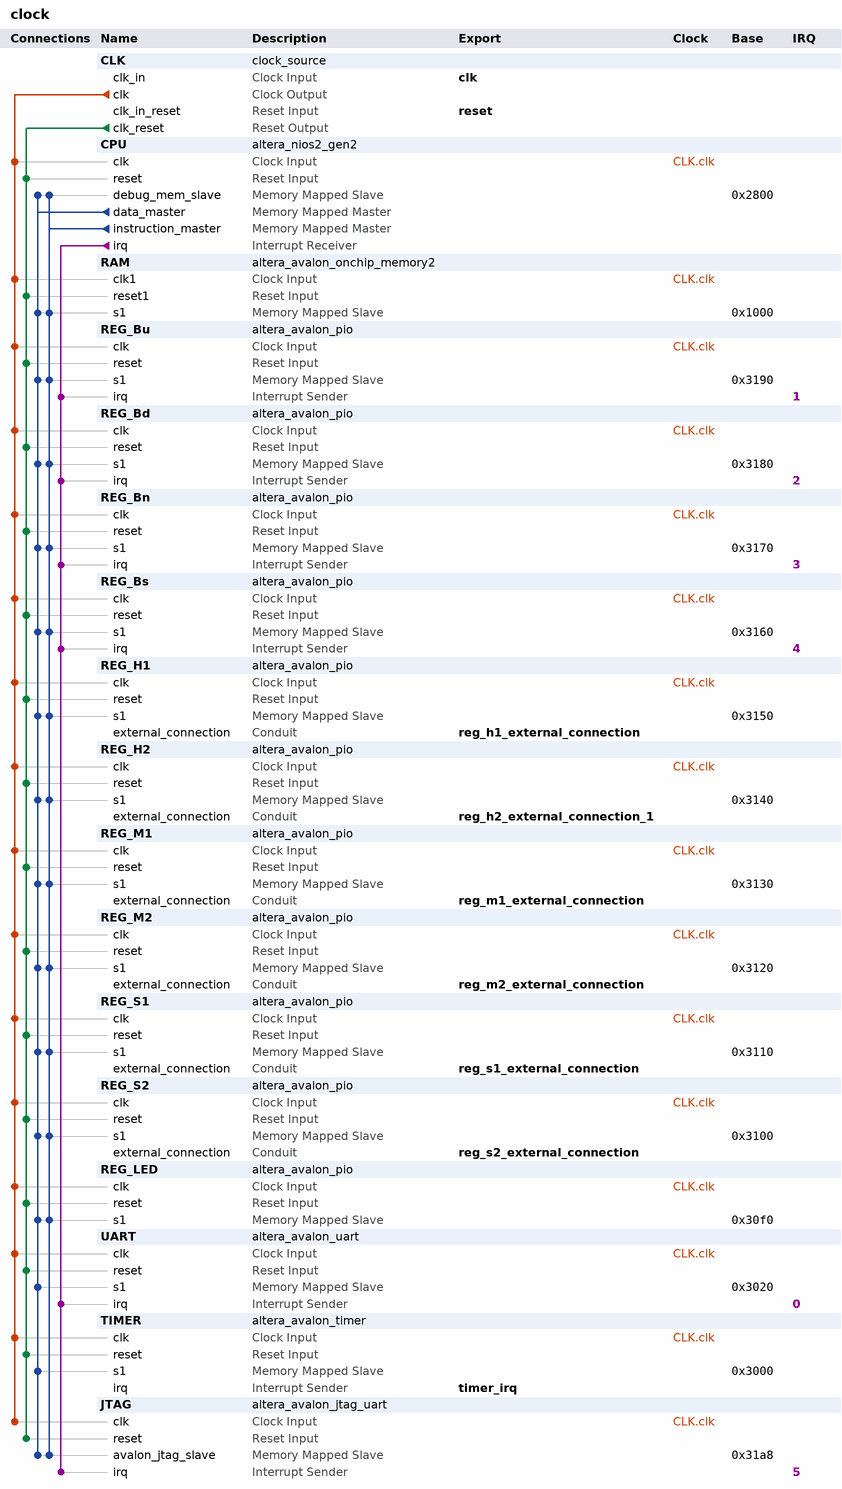
[diagram p0: system contents]
# Platform Designer (Qsys) system clock, Cyclone V 5CSEMA5F31C6
# Parameters at their usual value, and those the tool derives, are not listed.
package require -exact qsys 18.1
create_system clock
set_project_property DEVICE_FAMILY {Cyclone V}
set_project_property DEVICE 5CSEMA5F31C6

add_instance CLK clock_source 18.1
set_instance_parameter_value CLK clockFrequency 50000000

add_instance CPU altera_nios2_gen2 18.1
set_instance_parameter_value CPU dcache_size 2048
set_instance_parameter_value CPU exceptionSlave RAM.s1
set_instance_parameter_value CPU icache_size 4096
set_instance_parameter_value CPU impl Tiny
set_instance_parameter_value CPU resetSlave RAM.s1

add_instance RAM altera_avalon_onchip_memory2 18.1
set_instance_parameter_value RAM dataWidth 32
set_instance_parameter_value RAM dualPort false
set_instance_parameter_value RAM initMemContent true
set_instance_parameter_value RAM initializationFileName onchip_mem.hex
set_instance_parameter_value RAM memorySize 4096

add_instance REG_Bu altera_avalon_pio 18.1
set_instance_parameter_value REG_Bu direction Input
set_instance_parameter_value REG_Bu generateIRQ true
set_instance_parameter_value REG_Bu width 8

add_instance REG_Bd altera_avalon_pio 18.1
set_instance_parameter_value REG_Bd direction Input
set_instance_parameter_value REG_Bd generateIRQ true
set_instance_parameter_value REG_Bd width 8

add_instance REG_Bn altera_avalon_pio 18.1
set_instance_parameter_value REG_Bn direction Input
set_instance_parameter_value REG_Bn generateIRQ true
set_instance_parameter_value REG_Bn width 8

add_instance REG_Bs altera_avalon_pio 18.1
set_instance_parameter_value REG_Bs direction Input
set_instance_parameter_value REG_Bs generateIRQ true
set_instance_parameter_value REG_Bs width 8

add_instance REG_H1 altera_avalon_pio 18.1
set_instance_parameter_value REG_H1 direction Output
set_instance_parameter_value REG_H1 width 8

add_instance REG_H2 altera_avalon_pio 18.1
set_instance_parameter_value REG_H2 direction Output
set_instance_parameter_value REG_H2 width 8

add_instance REG_M1 altera_avalon_pio 18.1
set_instance_parameter_value REG_M1 direction Output
set_instance_parameter_value REG_M1 width 8

add_instance REG_M2 altera_avalon_pio 18.1
set_instance_parameter_value REG_M2 direction Output
set_instance_parameter_value REG_M2 width 8

add_instance REG_S1 altera_avalon_pio 18.1
set_instance_parameter_value REG_S1 direction Output
set_instance_parameter_value REG_S1 width 8

add_instance REG_S2 altera_avalon_pio 18.1
set_instance_parameter_value REG_S2 direction Output
set_instance_parameter_value REG_S2 width 8

add_instance REG_LED altera_avalon_pio 18.1
set_instance_parameter_value REG_LED direction Output
set_instance_parameter_value REG_LED width 8

add_instance UART altera_avalon_uart 18.1
set_instance_parameter_value UART baud 115200
set_instance_parameter_value UART dataBits 8
set_instance_parameter_value UART fixedBaud true
set_instance_parameter_value UART parity NONE
set_instance_parameter_value UART stopBits 1

add_instance TIMER altera_avalon_timer 18.1
set_instance_parameter_value TIMER period 1
set_instance_parameter_value TIMER periodUnits SEC

add_instance JTAG altera_avalon_jtag_uart 18.1
set_instance_parameter_value JTAG simInteractiveOptions NO_INTERACTIVE_WINDOWS

# connections
add_connection CLK.clk CPU.clk clock
add_connection CLK.clk JTAG.clk clock
add_connection CLK.clk RAM.clk1 clock
add_connection CLK.clk REG_Bd.clk clock
add_connection CLK.clk REG_Bn.clk clock
add_connection CLK.clk REG_Bs.clk clock
add_connection CLK.clk REG_Bu.clk clock
add_connection CLK.clk REG_H1.clk clock
add_connection CLK.clk REG_H2.clk clock
add_connection CLK.clk REG_LED.clk clock
add_connection CLK.clk REG_M1.clk clock
add_connection CLK.clk REG_M2.clk clock
add_connection CLK.clk REG_S1.clk clock
add_connection CLK.clk REG_S2.clk clock
add_connection CLK.clk TIMER.clk clock
add_connection CLK.clk UART.clk clock
add_connection CLK.clk_reset CPU.reset reset
add_connection CLK.clk_reset JTAG.reset reset
add_connection CLK.clk_reset RAM.reset1 reset
add_connection CLK.clk_reset REG_Bd.reset reset
add_connection CLK.clk_reset REG_Bn.reset reset
add_connection CLK.clk_reset REG_Bs.reset reset
add_connection CLK.clk_reset REG_Bu.reset reset
add_connection CLK.clk_reset REG_H1.reset reset
add_connection CLK.clk_reset REG_H2.reset reset
add_connection CLK.clk_reset REG_LED.reset reset
add_connection CLK.clk_reset REG_M1.reset reset
add_connection CLK.clk_reset REG_M2.reset reset
add_connection CLK.clk_reset REG_S1.reset reset
add_connection CLK.clk_reset REG_S2.reset reset
add_connection CLK.clk_reset TIMER.reset reset
add_connection CLK.clk_reset UART.reset reset
add_connection CPU.data_master CPU.debug_mem_slave avalon
set_connection_parameter_value CPU.data_master/CPU.debug_mem_slave baseAddress 0x2800
add_connection CPU.data_master JTAG.avalon_jtag_slave avalon
set_connection_parameter_value CPU.data_master/JTAG.avalon_jtag_slave baseAddress 0x31a8
add_connection CPU.data_master RAM.s1 avalon
set_connection_parameter_value CPU.data_master/RAM.s1 baseAddress 0x1000
add_connection CPU.data_master REG_Bd.s1 avalon
set_connection_parameter_value CPU.data_master/REG_Bd.s1 baseAddress 0x3180
add_connection CPU.data_master REG_Bn.s1 avalon
set_connection_parameter_value CPU.data_master/REG_Bn.s1 baseAddress 0x3170
add_connection CPU.data_master REG_Bs.s1 avalon
set_connection_parameter_value CPU.data_master/REG_Bs.s1 baseAddress 0x3160
add_connection CPU.data_master REG_Bu.s1 avalon
set_connection_parameter_value CPU.data_master/REG_Bu.s1 baseAddress 0x3190
add_connection CPU.data_master REG_H1.s1 avalon
set_connection_parameter_value CPU.data_master/REG_H1.s1 baseAddress 0x3150
add_connection CPU.data_master REG_H2.s1 avalon
set_connection_parameter_value CPU.data_master/REG_H2.s1 baseAddress 0x3140
add_connection CPU.data_master REG_LED.s1 avalon
set_connection_parameter_value CPU.data_master/REG_LED.s1 baseAddress 0x30f0
add_connection CPU.data_master REG_M1.s1 avalon
set_connection_parameter_value CPU.data_master/REG_M1.s1 baseAddress 0x3130
add_connection CPU.data_master REG_M2.s1 avalon
set_connection_parameter_value CPU.data_master/REG_M2.s1 baseAddress 0x3120
add_connection CPU.data_master REG_S1.s1 avalon
set_connection_parameter_value CPU.data_master/REG_S1.s1 baseAddress 0x3110
add_connection CPU.data_master REG_S2.s1 avalon
set_connection_parameter_value CPU.data_master/REG_S2.s1 baseAddress 0x3100
add_connection CPU.data_master TIMER.s1 avalon
set_connection_parameter_value CPU.data_master/TIMER.s1 baseAddress 0x3000
add_connection CPU.data_master UART.s1 avalon
set_connection_parameter_value CPU.data_master/UART.s1 baseAddress 0x3020
add_connection CPU.instruction_master CPU.debug_mem_slave avalon
set_connection_parameter_value CPU.instruction_master/CPU.debug_mem_slave baseAddress 0x2800
add_connection CPU.instruction_master JTAG.avalon_jtag_slave avalon
set_connection_parameter_value CPU.instruction_master/JTAG.avalon_jtag_slave baseAddress 0x31a8
add_connection CPU.instruction_master RAM.s1 avalon
set_connection_parameter_value CPU.instruction_master/RAM.s1 baseAddress 0x1000
add_connection CPU.instruction_master REG_Bd.s1 avalon
set_connection_parameter_value CPU.instruction_master/REG_Bd.s1 baseAddress 0x3180
add_connection CPU.instruction_master REG_Bn.s1 avalon
set_connection_parameter_value CPU.instruction_master/REG_Bn.s1 baseAddress 0x3170
add_connection CPU.instruction_master REG_Bs.s1 avalon
set_connection_parameter_value CPU.instruction_master/REG_Bs.s1 baseAddress 0x3160
add_connection CPU.instruction_master REG_Bu.s1 avalon
set_connection_parameter_value CPU.instruction_master/REG_Bu.s1 baseAddress 0x3190
add_connection CPU.instruction_master REG_H1.s1 avalon
set_connection_parameter_value CPU.instruction_master/REG_H1.s1 baseAddress 0x3150
add_connection CPU.instruction_master REG_H2.s1 avalon
set_connection_parameter_value CPU.instruction_master/REG_H2.s1 baseAddress 0x3140
add_connection CPU.instruction_master REG_LED.s1 avalon
set_connection_parameter_value CPU.instruction_master/REG_LED.s1 baseAddress 0x30f0
add_connection CPU.instruction_master REG_M1.s1 avalon
set_connection_parameter_value CPU.instruction_master/REG_M1.s1 baseAddress 0x3130
add_connection CPU.instruction_master REG_M2.s1 avalon
set_connection_parameter_value CPU.instruction_master/REG_M2.s1 baseAddress 0x3120
add_connection CPU.instruction_master REG_S1.s1 avalon
set_connection_parameter_value CPU.instruction_master/REG_S1.s1 baseAddress 0x3110
add_connection CPU.instruction_master REG_S2.s1 avalon
set_connection_parameter_value CPU.instruction_master/REG_S2.s1 baseAddress 0x3100
add_connection CPU.irq JTAG.irq interrupt
set_connection_parameter_value CPU.irq/JTAG.irq irqNumber 5
add_connection CPU.irq REG_Bd.irq interrupt
set_connection_parameter_value CPU.irq/REG_Bd.irq irqNumber 2
add_connection CPU.irq REG_Bn.irq interrupt
set_connection_parameter_value CPU.irq/REG_Bn.irq irqNumber 3
add_connection CPU.irq REG_Bs.irq interrupt
set_connection_parameter_value CPU.irq/REG_Bs.irq irqNumber 4
add_connection CPU.irq REG_Bu.irq interrupt
set_connection_parameter_value CPU.irq/REG_Bu.irq irqNumber 1
add_connection CPU.irq UART.irq interrupt
set_connection_parameter_value CPU.irq/UART.irq irqNumber 0

# exported interfaces
add_interface clk clock sink
set_interface_property clk EXPORT_OF CLK.clk_in
add_interface reg_h1_external_connection conduit end
set_interface_property reg_h1_external_connection EXPORT_OF REG_H1.external_connection
add_interface reg_h2_external_connection_1 conduit end
set_interface_property reg_h2_external_connection_1 EXPORT_OF REG_H2.external_connection
add_interface reg_m1_external_connection conduit end
set_interface_property reg_m1_external_connection EXPORT_OF REG_M1.external_connection
add_interface reg_m2_external_connection conduit end
set_interface_property reg_m2_external_connection EXPORT_OF REG_M2.external_connection
add_interface reg_s1_external_connection conduit end
set_interface_property reg_s1_external_connection EXPORT_OF REG_S1.external_connection
add_interface reg_s2_external_connection conduit end
set_interface_property reg_s2_external_connection EXPORT_OF REG_S2.external_connection
add_interface reset reset sink
set_interface_property reset EXPORT_OF CLK.clk_in_reset
add_interface timer_irq interrupt sender
set_interface_property timer_irq EXPORT_OF TIMER.irq

set_interconnect_requirement {$system} qsys_mm.clockCrossingAdapter HANDSHAKE
set_interconnect_requirement {$system} qsys_mm.enableEccProtection FALSE
set_interconnect_requirement {$system} qsys_mm.insertDefaultSlave FALSE
set_interconnect_requirement {$system} qsys_mm.maxAdditionalLatency 1

save_system clock.qsys
